# EAGLE design RemoteReceiverDecoder (EAGLE 5.10)
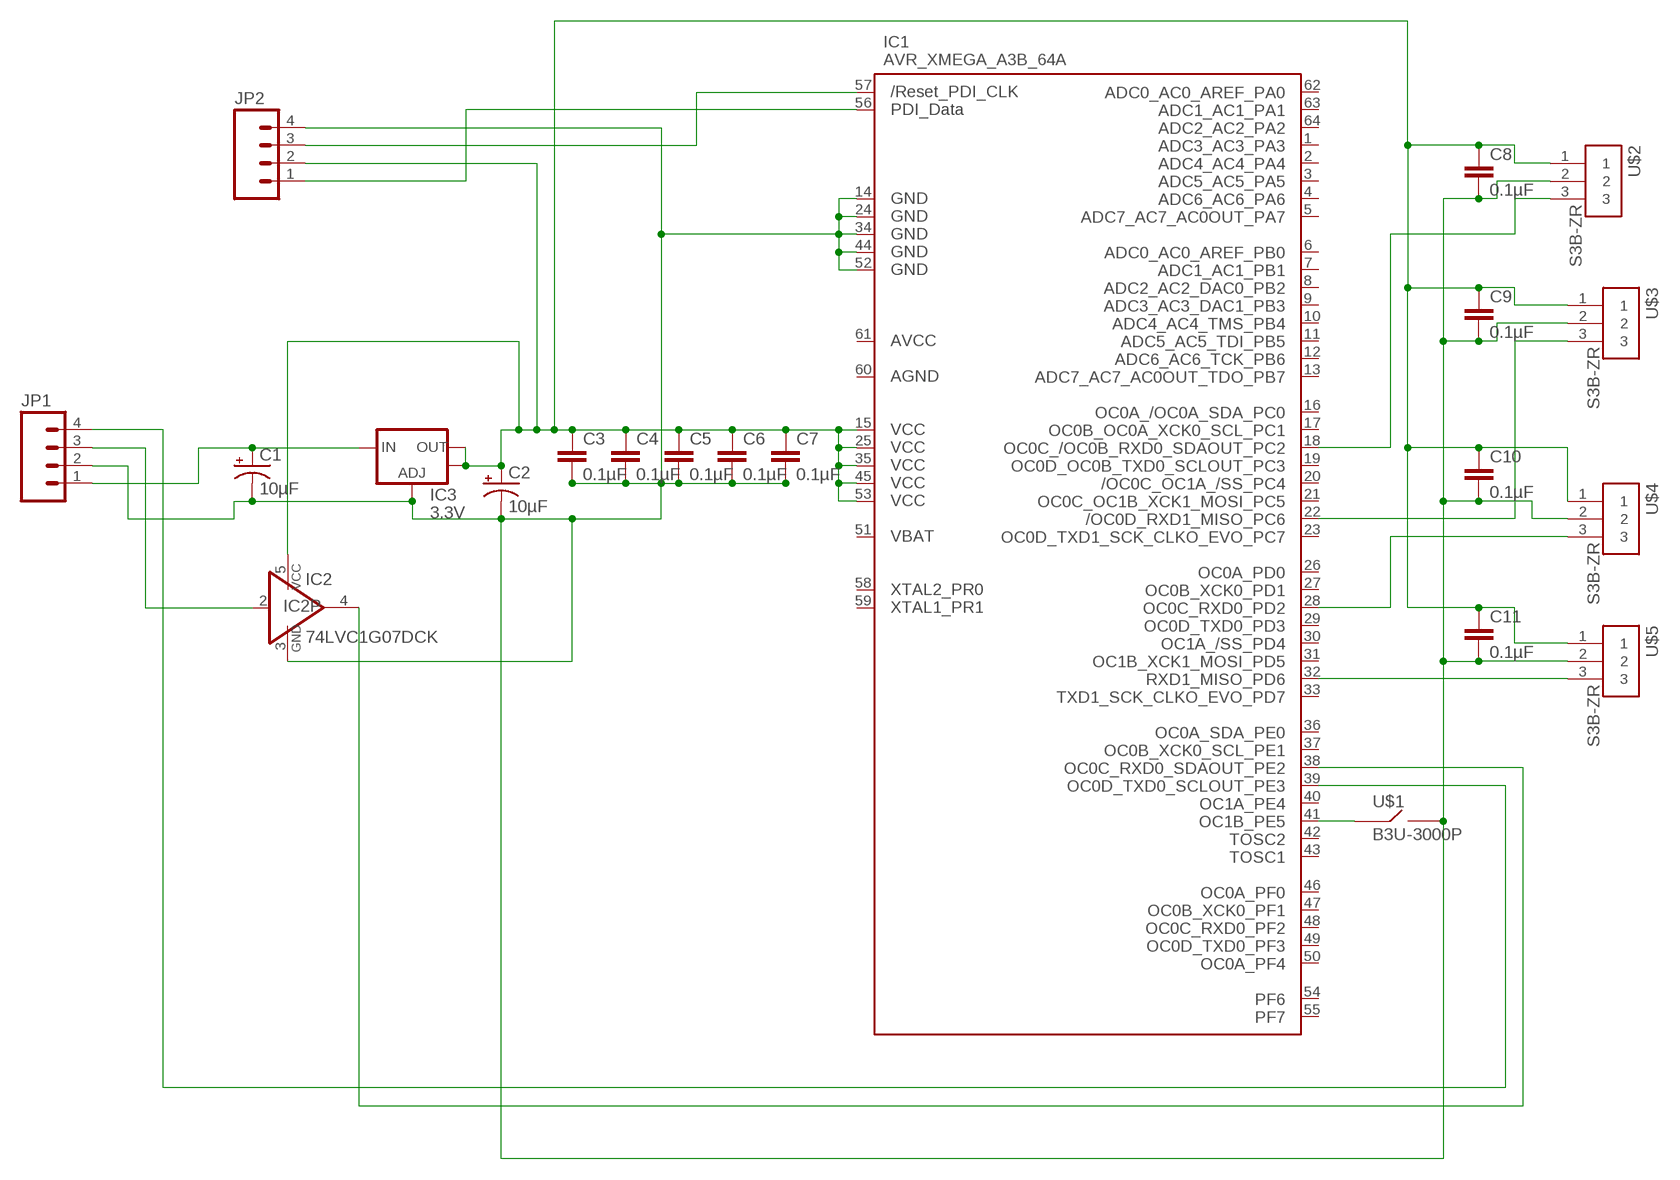
[diagram p0: schematic, sheet 1]

## Parts
C1  10µF  CPOL-USCT6032  [CT6032]
C2  10µF  CAP_POL1206  [EIA3216]
C3  0.1µF  CAP0402-CAP  [0402-CAP]
C4  0.1µF  CAP0402-CAP  [0402-CAP]
C5  0.1µF  CAP0402-CAP  [0402-CAP]
C6  0.1µF  CAP0402-CAP  [0402-CAP]
C7  0.1µF  CAP0402-CAP  [0402-CAP]
C8  0.1µF  CAP0402-CAP  [0402-CAP]
C9  0.1µF  CAP0402-CAP  [0402-CAP]
C10  0.1µF  CAP0402-CAP  [0402-CAP]
C11  0.1µF  CAP0402-CAP  [0402-CAP]
IC1  AVR_XMEGA_A3B_64A  [TQFP64]
IC2  74LVC1G07DCK  [SC70-5]
IC3  3.3V  V_REG_LM1117SOT223  [SOT223]
JP1  M041X04_NO_SILK  [1X04_NO_SILK]
JP2  M04LOCK  [1X04_LOCK]
U$1  B3U-3000P  [B3U-1000P]
U$2  S3B-ZR  [JST_S3B-ZR]
U$3  S3B-ZR  [JST_S3B-ZR]
U$4  S3B-ZR  [JST_S3B-ZR]
U$5  S3B-ZR  [JST_S3B-ZR]

## Nets
GND: C1.- C2.C(-) C3.2 C4.2 C5.2 C6.2 C7.2 C8.2 C9.2 C10.2 C11.2 IC1.14(GND1) IC1.24(GND2) IC1.34(GND3) IC1.44(GND4) IC1.52(GND5) IC2.3(GND) IC3.1(ADJ) JP1.2 JP2.4 U$1.2(OUTPUT) U$2.2 U$3.2 U$4.2 U$5.2
N$1: IC2.2(I) JP1.3
N$2: IC1.38(PE2) IC2.4(O)
N$3: C1.+ IC3.3(IN) JP1.1
N$4: IC1.18(PC2) U$2.3
N$5: IC1.22(PC6) U$3.3
N$6: IC1.28(PD2) U$4.3
N$7: IC1.32(PD6) U$5.3
N$8: IC1.39(PE3) JP1.4
N$9: IC1.41(PE5) U$1.1(INPUT)
N$10: IC1.56(PDI_DATA) JP2.1
N$11: C2.A(+) C3.1 C4.1 C5.1 C6.1 C7.1 C8.1 C9.1 C10.1 C11.1 IC1.15(VCC1) IC1.25(VCC2) IC1.35(VCC3) IC1.45(VCC4) IC1.53(VCC5) IC2.5(VCC) IC3.2(OUT) IC3.4(OUT) JP2.2 U$2.1 U$3.1 U$4.1 U$5.1
N$12: IC1.57(RESET) JP2.3
Unconnected: IC1.1(PA3) IC1.2(PA4) IC1.3(PA5) IC1.4(PA6) IC1.5(PA7) IC1.6(PB0) IC1.7(PB1) IC1.8(PB2) IC1.9(PB3) IC1.10(PB4) IC1.11(PB5) IC1.12(PB6) IC1.13(PB7) IC1.16(PC0) IC1.17(PC1) IC1.19(PC3) IC1.20(PC4) IC1.21(PC5) IC1.23(PC7) IC1.26(PD0) IC1.27(PD1) IC1.29(PD3) IC1.30(PD4) IC1.31(PD5) IC1.33(PD7) IC1.36(PE0) IC1.37(PE1) IC1.40(PE4) IC1.42(TOSC2) IC1.43(TOSC1) IC1.46(PF0) IC1.47(PF1) IC1.48(PF2) IC1.49(PF3) IC1.50(PF4) IC1.51(VBAT) IC1.54(PF6) IC1.55(PF7) IC1.58(PR0) IC1.59(PR1) IC1.60(AGND) IC1.61(AVCC) IC1.62(PA0) IC1.63(PA1) IC1.64(PA2)

## Library data of the parts
C1 = resistor:CPOL-US: POLARIZED CAPACITOR, American symbol
C2 = SparkFun:CAP_POL: Capacitor Polarized These are standard SMD and PTH capacitors. Normally 10uF, 47uF, and 100uF in electrolytic and tantalum varieties. Always verify the external diameter of the through hole cap, it varies with capacity, voltage, and manufacturer. The EIA devices should be standard.
C3-C11 = SparkFun:CAP: Capacitor Standard 0603 ceramic capacitor, and 0.1" leaded capacitor.
IC1 = xmega:AVR_XMEGA_A3B_: Device for Atmel AVR XMEGA A3B Series
IC2 = 74xx-little-de:74*1G07: Single Buffer/Driver With Open-Drain Output
IC3 = SparkFun:V_REG_LM1117: Voltage Regulator LM1117 Standard adjustable voltage regulator but in SMD form. Spark Fun Electronics SKU : COM-00595
JP1 JP2 = SparkFun:M04: Header 4 Standard 4-pin 0.1" header. Use with straight break away headers (SKU : PRT-00116), right angle break away headers (PRT-00553), swiss pins (PRT-00743), machine pins (PRT-00117), and female headers (PRT-00115). Molex polarized connector foot print use with SKU : PRT-08231 with associated crimp pins and housings.
U$1 = jesseSheridan:B3U-3000P
U$2-U$5 = jesseSheridan:S3B-ZR

## Board
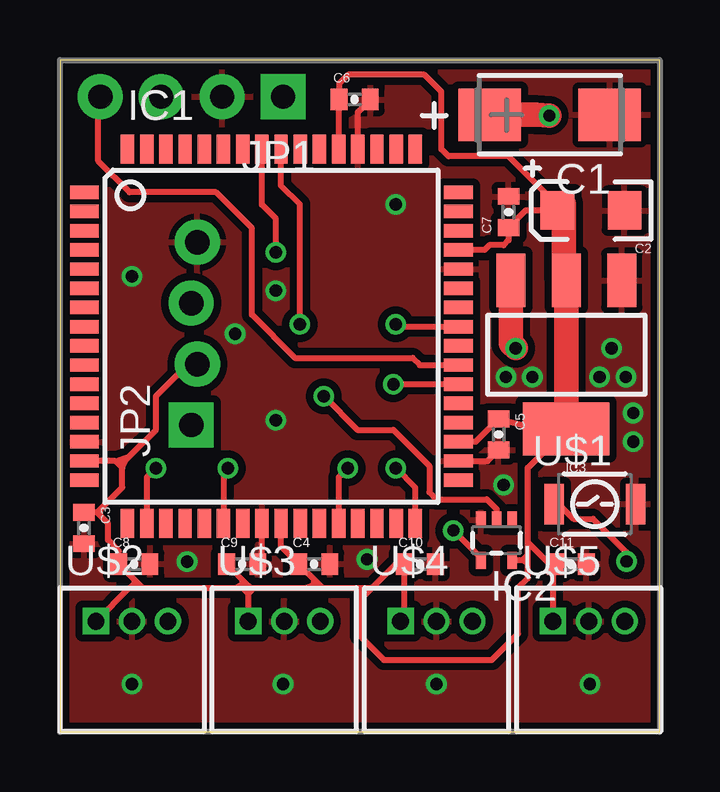
[diagram p1: board, top side]
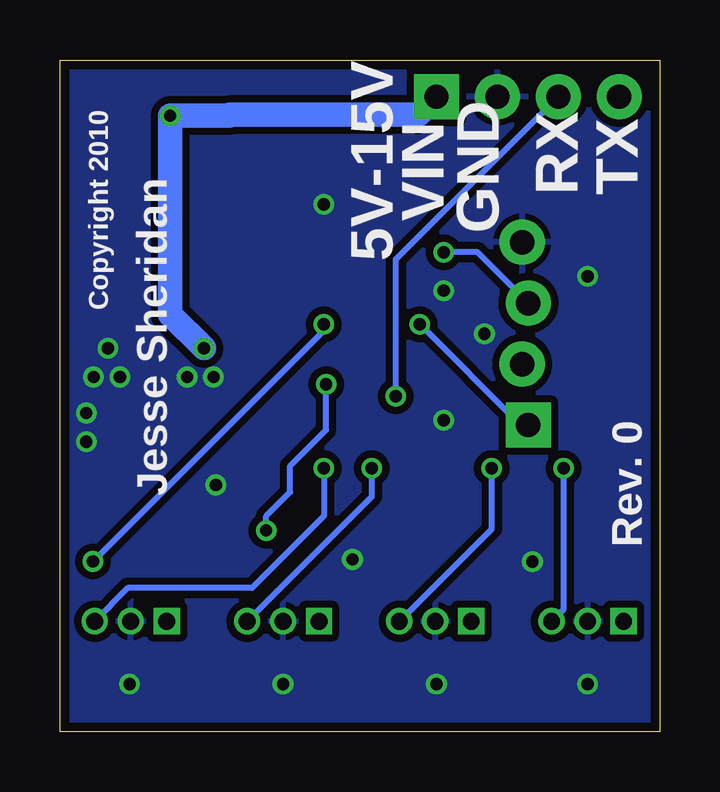
[diagram p2: board, bottom side, seen from below]

Size 25 x 28.02 mm. Coordinates in mm from the lower left corner, seen from the top.
Outline: 0,0 25,0 25,28.02 0,28.02 0,0
Copper layers (1*16): Top 0.0356mm / dielectric 1.5011mm / Bottom 0.0356mm
Design rules "LaenPCBOrder": minimum track width 6mil, minimum drill 13mil, track to track 6mil, track to pad 6mil, pad to pad 6mil, via to via 6mil, smd to smd 6mil, copper to edge 15mil, drill to drill 6mil, minimum pad ring 7mil, minimum via ring 7mil, stop-mask expansion 4mil, vias tented up to drill 0mil, thermal gap 10mil

### Footprints (pad centres in the part's own frame; a part is rotated, then mirrored left to right if it is on the bottom)
CT6032 = smd 2.6 x 2.2: + 2.5,0; - -2.5,0
EIA3216 = smd 1.4 x 1.6: A 1.4,0; C -1.4,0
0402-CAP = smd 0.7 x 0.9: 1 -0.65,0; 2 0.65,0
TQFP64 = smd 1.194 x 0.559: 1 -7.8,6; 2 -7.8,5.2; 3 -7.8,4.4; 4 -7.8,3.6; 5 -7.8,2.8; 6 -7.8,2; 7 -7.8,1.2; 8 -7.8,0.4; 9 -7.8,-0.4; 10 -7.8,-1.2; 11 -7.8,-2; 12 -7.8,-2.8; 13 -7.8,-3.6; 14 -7.8,-4.4; 15 -7.8,-5.2; 16 -7.8,-6; 33 7.8,-6; 34 7.8,-5.2; 35 7.8,-4.4; 36 7.8,-3.6; 37 7.8,-2.8; 38 7.8,-2; 39 7.8,-1.2; 40 7.8,-0.4; 41 7.8,0.4; 42 7.8,1.2; 43 7.8,2; 44 7.8,2.8; 45 7.8,3.6; 46 7.8,4.4; 47 7.8,5.2; 48 7.8,6 | smd 0.559 x 1.194: 17 -6,-7.8; 18 -5.2,-7.8; 19 -4.4,-7.8; 20 -3.6,-7.8; 21 -2.8,-7.8; 22 -2,-7.8; 23 -1.2,-7.8; 24 -0.4,-7.8; 25 0.4,-7.8; 26 1.2,-7.8; 27 2,-7.8; 28 2.8,-7.8; 29 3.6,-7.8; 30 4.4,-7.8; 31 5.2,-7.8; 32 6,-7.8; 49 6,7.8; 50 5.2,7.8; 51 4.4,7.8; 52 3.6,7.8; 53 2.8,7.8; 54 2,7.8; 55 1.2,7.8; 56 0.4,7.8; 57 -0.4,7.8; 58 -1.2,7.8; 59 -2,7.8; 60 -2.8,7.8; 61 -3.6,7.8; 62 -4.4,7.8; 63 -5.2,7.8; 64 -6,7.8
SC70-5 = smd 0.4 x 0.7: 1 -0.65,-0.85; 2 0,-0.85; 3 0.65,-0.85; 4 0.65,0.85; 5 -0.65,0.85
SOT223 = smd 1.219 x 2.235: 1 -2.311,-3.099; 2 0,-3.099; 3 2.311,-3.099 | smd 3.6 x 2.2: 4 0,3.099
1X04_NO_SILK = drill 1.016 pad 1.88 square: 1 0,0 | drill 1.016 pad 1.88 round: 2 2.54,0; 3 5.08,0; 4 7.62,0
1X04_LOCK = drill 1.016 pad 1.88 square: 1 0,0.127 | drill 1.016 pad 1.88 round: 2 2.54,-0.127; 3 5.08,0.127; 4 7.62,-0.127
B3U-1000P = smd 0.8 x 1.7: 1 -1.7,0; 2 1.7,0
JST_S3B-ZR = drill 0.7 pad 1.1 square: 1 -1.5,0 | drill 0.7 pad 1.1 round: 2 0,0; 3 1.5,0

### Placement (x,y rotation side)
C1  20.42,25.73 180 top
C2  22.14,21.75 180 top
C3  1,8.5 270 top
C4  10.6,7 0 top
C5  18.29,12.4 270 top
C6  12.29,26.37 0 top
C7  18.7,21.68 90 top
C8  3.1,7 0 top
C9  7.6,7 0 top
C10  15,7 0 top
C11  21.3,7 0 top
IC1  8.82,16.5 0 top
IC2  18.2,8 180 top
IC3  21.11,15.73 180 top
JP1  9.3,26.49 180 top
JP2  5.6,12.8 90 top
U$1  22.3,9.5 0 top
U$2  3,4.62 0 top
U$3  9.35,4.62 0 top
U$4  15.7,4.62 0 top
U$5  22.05,4.62 0 top

### Tracks (layer width: path | path; a pad name or v marks a point on that pad's centre or on a via)
GND  (via drill 0.51)
  Top 0.254: IC1.24 8.42,7.17 C9.2 | C5.2 17.83,11.3 IC1.34 | C6.2 12.42,25.85 IC1.52
  other vias: 5.3,7.1 9,13 12.8,7.2 3,2 9.3,2 15.7,2 22.1,2 18.5,10.3 3,19 14,22 23,16 9,18.4 7.3,16.6 23.9,12.1 23.9,13.3 18.6,14.8 19.7,14.8 22.5,14.8 23.6,14.8
  pour Top (isolate 0.305): -2.54,29.83 26.48,29.83 26.48,-2.54 -2.54,-2.54
  pour Bottom (isolate 0.305): -3.81,28.1 25.94,28.1 25.94,-4.08 -3.81,-4.08
N$1  (via drill 0.51)
  Top 0.254: IC2.2 18.2,9.3 17.8,9.7 15.7,9.7 15.4,10 15.4,11.1 13.9,12.6 12.4,12.6 v11,14
  Bottom 0.254: v11,14 11,19.71 JP1.3
N$2  (via drill 0.51)
  Top 0.254: IC2.4 17.55,7.25 v16.4,8.4 | v13.9,14.5 IC1.38
  Bottom 0.254: v16.4,8.4 16.4,9 15.4,10 15.4,11.1 13.9,12.6 v13.9,14.5
N$3  (via drill 0.51)
  Top 0.254: IC3.3 19,18.63
  Top 1.016: v20.4,25.7 19.87,25.73 C1.+ | v19,16 18.8,16.2 IC3.3
  Bottom 1.016: JP1.1 10.06,25.73 C1.+ 17.95,25.7 v20.4,25.7 20.4,17.4 v19,16
N$4  (via drill 0.51)
  Top 0.254: v4,11 3.62,10.62 IC1.18
  Bottom 0.254: U$2.3 4,5.12 v4,11
N$5  (via drill 0.51)
  Top 0.254: v7,11 6.82,10.82 IC1.22
  Bottom 0.254: U$3.3 7,8.47 v7,11
N$6  (via drill 0.51)
  Top 0.254: v12,11 11.62,10.62 IC1.28
  Bottom 0.254: U$4.3 12,9.82 v12,11
N$7  (via drill 0.51)
  Top 0.254: v14,11 14.82,10.18 IC1.32
  Bottom 0.254: U$5.3 22.17,6 17,6 14,9 v14,11
N$8
  Top 0.254: IC1.39 15,15.3 14.7,15.6 9.8,15.6 8,17.4 8,21 6.5,22.5 2.9,22.5 1.6,23.8 1.6,26.41 JP1.4
N$9  (via drill 0.51)
  Top 0.254: IC1.41 14.1,16.9 v14,17 | U$1.1 20.7,9.6 21.41,8.89 22.23,8.89 23.62,7.49 v23.62,7.11
  Bottom 0.254: v23.62,7.11 14,16.73 v14,17
N$10  (via drill 0.51)
  Top 0.254: v10,17 10,22 9.22,22.78 IC1.56
  Bottom 0.254: JP2.1 5.8,12.8 v10,17
N$11
  Top 0.203: 2.8,11.4 2.6,11 2.3,11.3 2.9,11.5 | 1.7,9 1.7,9.3 | 3.1,6.1 3.2,6.2 | 3,6 3.1,6.1 | 3.1,6.2 3.1,6.3 | 3.1,6.2 3.1,6.1 | 2.9,6 3.1,6.2 | 7.6,6 7.8,5.8 | 8.1,6 7.9,5.8 | 19.5,7.4 19.3,7.2 | 12.5,6 12.7,5.7 | 12.5,5.5 12.7,5.9 | 12.5,5.8 12.5,5.3 | 12.5,5.8 12.5,5.9 | 12.2,6 12.5,5.8 | 10.2,6 10.7,6.2 | 10.5,6 10.6,6.3 | 7.5,6 7.6,6.1 | 7.6,6.1 7.7,6.2 | 7.6,6.2 7.6,6.1 | 7.6,6.2 7.6,6.3 | 7.3,6 7.6,6.2
  Top 0.254: C2.A 19.41,21.75 C7.1 18.7,20.5 18.5,20.3 17.9,20.3 17.7,20.1 IC1.45 | C2.A 21.11,21.38 | 20.84,12.36 IC3.4 | 20.84,12.36 C5.1 17.33,12.1 IC1.35 | 20.84,12.36 19.5,11.02 19.5,7.9 | 19.5,7.9 20.4,7 C11.1 20.55,6.9 U$5.1 | U$4.1 14.35,4.77 C10.1 14,7 13,6 | IC1.25 9.22,7.73 C4.1 10.95,6 | 10.95,6 12.2,6 12.5,6 13,6 | 7.85,6.1 C9.1 | 7.85,6.1 U$3.1 | 7.95,6 7.85,6.1 | 7.95,6 8.1,6 10.2,6 10.5,6 10.95,6 | 3.45,6 C8.1 2.45,7.55 2,8 2,8.7 1.7,9 1.55,9.15 | 3.45,6 7.3,6 7.5,6 7.6,6 7.95,6 | 19.5,7 19.5,6.4 19.1,6 19.1,4.1 18,3 13.5,3 12.5,4 12.5,5.3 12.5,5.5 12.7,5.7 13,6 | 19.5,7 19.5,7.4 19.5,7.9 | IC2.5 19.35,7.15 19.5,7 | 3.45,6 3,6 2.9,6 2.88,6 U$2.1 | 1.55,9.15 C3.1 | 1.55,9.15 1.7,9.3 2.6,10.2 2.6,11 2.6,11.2 2.5,11.3 | 2.5,11.3 2.3,11.3 IC1.15 | C2.A 20.74,21.96 18.7,24 16.2,24 15.9,24.3 15.9,26.7 15.2,27.4 12,27.4 11.64,27.04 C6.1 11.62,26.35 IC1.53 | 2.5,11.3 2.7,11.3 2.8,11.4 2.9,11.5 4,12.6 4,14 5.34,15.34 JP2.2
  Top 1.016: C2.A 21,22 21,18.94 IC3.2 IC3.4
N$12  (via drill 0.51)
  Top 0.254: v9,20 9,21.4 8.42,21.98 IC1.57
  Bottom 0.254: JP2.3 7.59,20 v9,20

### Text on the board
bPlace: 5V-15V | Jesse Sheridan | TX | RX | GND | VIN | Copyright 2010 | Rev. 0